# EAGLE design 255SB to Switch SMD (EAGLE 9.4.0)
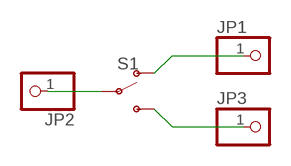
[diagram p0: schematic, sheet 1]

## Parts
JP1  PINHD-1X01_2.54-SMD  [1X01SMD]
JP2  PINHD-1X01_2.54-SMD  [1X01SMD]
JP3  PINHD-1X01_2.54-SMD  [1X01SMD]
S1  SWITCH-SPDT-SMD-AYZ0202  [SWITCH_DPDT_SMD_AYZ0202]

## Nets
N$1: JP2.1 S1.2(P)
N$2: JP1.1 S1.1(O)
N$3: JP3.1 S1.3(S)

## Library data of the parts
JP1-JP3 = pinhead-2:PINHD-1X01: PIN HEADER
S1 = SparkFun-Switches:SWITCH-SPDT: Single Pole, Double Throw (SPDT) Switch Single-pole, double-throw (SPDT) switch. Variant Overview SMD-AYZ0202 Surface Mount DPDT Switch <https://www.sparkfun.com/products/597> (COM-00597) Used on e.g. LilyPad Arduino USB - ATmega32U4 Board <https://www.sparkfun.com/products/12049> PTH-11.6X4.0MM SPDT Mini Power Switch <https://www.sparkfun.com/products/102> (COM-00102) Used on e.g. SparkFun Simon Says - Through-Hole Soldering Kit <https://www.sparkfun.com/products/10547> (KIT-10547) PTH-11.6X4.0MM-KIT KIT version of SPDT Mini Power Switch - Simplifies soldering by removing tStop of switch pins - only one side can be soldered. PTH-11.6X4.0MM-LOCK LOCK version of SPDT Mini Power Switch - Offset pins hold switch in place for easier soldering. SMD-RIGHT-ANGLE Surface Mount Right Angle Switch <https://www.sparkfun.com/products/10860> (COM-10860) Used on e.g. SparkFun ESP8266 Thing <https://www.sparkfun.com/products/13231>; PROD_ID: SWCH-08179; SF_ID: COM-00597

## Board
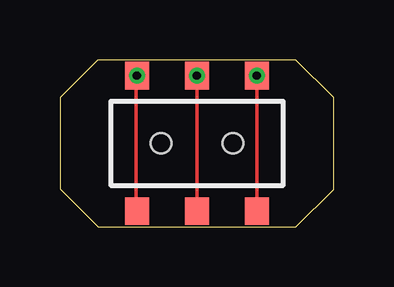
[diagram p1: board, top side]
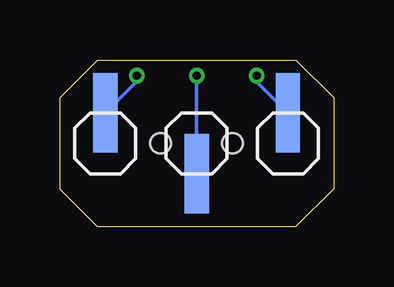
[diagram p2: board, bottom side, seen from below]

Size 11.42 x 6.97 mm. Coordinates in mm from the lower left corner, seen from the top.
Outline: 0,5.4 0,1.59 1.59,0 9.84,0 11.42,1.57 11.42,5.41 9.85,6.97 1.58,6.97 0,5.4
Copper layers (1*16): Top 0.035mm / dielectric 1.5mm / Bottom 0.035mm
Design rules "dirtypcbs_2_layer": minimum track width 5mil, minimum drill 12mil, track to track 5mil, track to pad 5mil, pad to pad 5mil, via to via 5mil, smd to smd 0mil, copper to edge 10mil, drill to drill 10mil, minimum pad ring 10mil, minimum via ring 6mil, stop-mask expansion 2mil, vias tented up to drill 25mil, thermal gap 10mil

### Footprints (pad centres in the part's own frame; a part is rotated, then mirrored left to right if it is on the bottom)
1X01SMD = smd 1.016 x 3.302: 1 -1.27,1.27
SWITCH_DPDT_SMD_AYZ0202 = smd 1 x 1.15: 1 -2.5,2.825; 2 0,2.825; 3 2.5,2.825; 4 -2.5,-2.825; 5 0,-2.825; 6 2.5,-2.825 | hole 0.85: 1.5,0; -1.5,0

### Placement (x,y rotation side)
JP1  0.64,3.49 0 bottom
JP2  6.99,3.49 180 bottom
JP3  8.26,3.49 0 bottom
S1  5.71,3.49 0 top

### Tracks (layer width: path | path; a pad name or v marks a point on that pad's centre or on a via)
N$1  (via drill 0.35)
  Top 0.152: S1.2 5.71,0.64
  Bottom 0.152: JP2.1 S1.2
  other vias: 5.71,6.32
N$2  (via drill 0.35)
  Top 0.152: S1.1 3.17,6.28 3.17,0.64
  Bottom 0.152: JP1.1 3.21,6.07 S1.1
  other vias: 3.21,6.32
N$3  (via drill 0.35)
  Top 0.152: S1.3 8.21,0.64
  Bottom 0.152: JP3.1 8.21,6.07 S1.3
  other vias: 8.21,6.32